# Altium schematic sheet BMS1.SchDoc
size A4; SheetNumber: 12; SheetTotal: 13
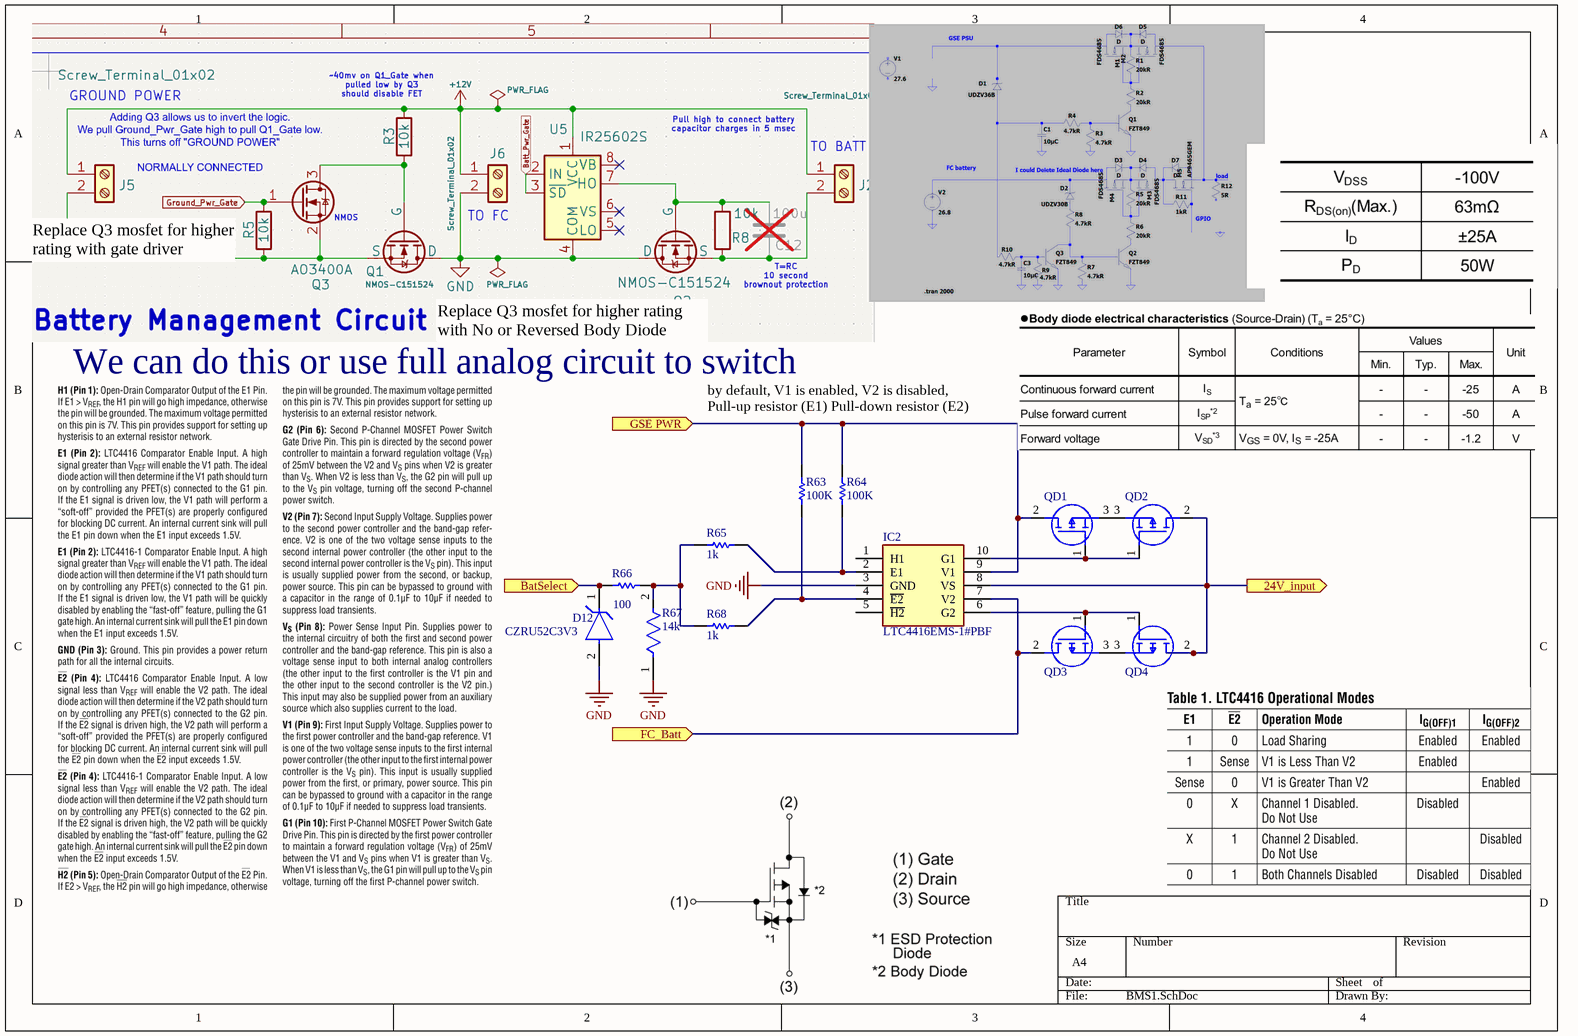
[diagram p0: BMS1.SchDoc]

## Parts
D12  CZRU52C3V3  [FP-0603-SOD-523F-MFG]
IC2  LTC4416EMS-1#PBF  [SOP50P490X110-10N]
QD1  (no value)  [R6024KNJTL]
QD2  (no value)  [R6024KNJTL]
QD3  (no value)  [R6024KNJTL]
QD4  (no value)  [R6024KNJTL]
R63  100K  [RESC1609X55X30ML10T20]
R64  100K  [RESC1609X55X30ML10T20]
R65  1k  [RESC2013X60X35ML10T20]
R66  100  [RESC1608X55X30LL15T15]
R67  14k  [FP-CRCW0603-e3-IPC_B]
R68  1k  [RESC2013X60X35ML10T20]

## Ports
24V_input (out), BatSelect (in), FC_Batt (in), GSE PWR (in)

## Nets
GND: D12.2(A) IC2.3(GND) R67.1
24V_input: IC2.8(VS) QD2.2(D) QD4.2(D) ; port 24V_input
BatSelect: D12.1(C) R66.1 ; port BatSelect
FC_Batt: IC2.7(V2) QD3.2(D) ; port FC_Batt
GSE PWR: IC2.9(V1) QD1.2(D) R63.2 R64.2 ; port GSE PWR
NetIC2_2: IC2.2(E1) R64.1 R65.2
NetIC2_4: IC2.4(~{E2}) R63.1 R68.2
NetIC2_6: IC2.6(G2) QD3.1(G) QD4.1(G)
NetIC2_10: IC2.10(G1) QD1.1(G) QD2.1(G)
NetQD1_3: QD1.3(S) QD2.3(S)
NetQD3_3: QD3.3(S) QD4.3(S)
NetR65_1: R65.1 R66.2 R67.2 R68.1

Not connected (* = marked no-connect by the designer): IC2 1(H1) 5(~{H2})

## Notes on the sheet
- Replace Q3 mosfet for higher rating with gate driver
- We can do this or use full analog circuit to switch
- Replace Q3 mosfet for higher rating with No or Reversed Body Diode
- by default, V1 is enabled, V2 is disabled, Pull-up resistor (E1) Pull-down resistor (E2)

## Library data of the parts
D12 = CMP-20229-000003-1: DIODE ZENER 3.3V 150MW 0603; Zener Current: 5mA; Tolerance: 5%; Output Current: 500mA; Impedance: 95R; Element Configuration: Single; Max Reverse Leakage Current: 25uA; Max Operating Temperature: 125°C; Max Power Dissipation: 150mW; Power Rating: 150mW; Lead Free: Lead Free; Mount: Surface Mount; Packaging: Tape and Reel; Voltage Tolerance: 5%; Power Dissipation: 150mW; Zener Voltage: 3.3V; Min Operating Temperature: -55°C; Case/Package: SMD/SMT; Voltage Rating (DC): 3.3V; Package Quantity: 1
IC2 = LTC4416EMS-1#PBF: Integrated Circuit; Manufacturer_Name: Analog Devices; Datasheet Link: https://www.analog.com/media/en/technical-documentation/data-sheets/4416fa.pdf; Height: 1.1mm; Manufacturer_Part_Number: LTC4416EMS-1#PBF; Mouser Part Number: 584-LTC4416EMS-1#PBF; Mouser Price/Stock: https://www.mouser.co.uk/ProductDetail/Analog-Devices/LTC4416EMS-1PBF?qs=hVkxg5c3xu9mDay6QbsUoQ%3D%3D; Arrow Part Number: LTC4416EMS-1#PBF; Arrow Price/Stock: https://www.arrow.com/en/products/ltc4416ems-1pbf/analog-devices?region=nac
QD1-QD4 = RSJ250P10FRATL: MOSFET (P-Channel) RSJ250P10FRATL; Manufacturer_Name: ROHM Semiconductor; Datasheet Link: https://fscdn.rohm.com/en/products/databook/datasheet/discrete/transistor/mosfet/rsj250p10fratl-e.pdf; Height: 4.7mm; Manufacturer_Part_Number: RSJ250P10FRATL; Mouser Part Number: 755-RSJ250P10FRATL; Mouser Price/Stock: https://www.mouser.co.uk/ProductDetail/ROHM-Semiconductor/RSJ250P10FRATL?qs=4v%252BiZTmLVHFYSXh0Zm27Bg%3D%3D
R63 R64 = CMP-2000-03687-1: RES 100K OHM 0.1% 1/10W 0603; Manufacturer: Vishay Dale; Part Number: TNPW0603100KBETA
R65 R68 = CMP-2100-03671-1: Chip Resistor, 1 KOhm, +/- 1%, 125 mW, -55 to 155 degC, 0805 (2012 Metric), RoHS, Tape and Reel; Manufacturer: Yageo; Temperature Coefficient: 100ppm/degreesC; Voltage Rating (DC): 150V; Max Power Dissipation: 125mW; Resistance: 1KOhm; Number of Pins: 2; Number of Terminations: 2; Datasheet URL: http://www.yageo.com/NewPortal/yageodocoutput?fileName=/pdf/R-Chip/PYu-RC_Group_51_RoHS_L_5.pdf; Length: 0.079inch; Package Description: 2-Pin Surface Mounted Device, Body 2 x 1.25 mm; Depth: 1.25mm; Height: 0.024inch; Military Standard: Not; Case/Package: 0805; Package Reference: 0805; RoHSCompliant: true; Lead Free: LeadFree; Packaging: TapeandReel; Package Quantity: 1; Datasheet Version: Rev. 5, 10/2016; Tolerance: 1%; Min Operating Temperature: -55degC; Voltage Rating: 150V; Composition: ThickFilm; Case Code (Imperial): 0805; Power Rating: 125mW; Width: 0.049inch; Case Code (Metric): 2012; Manufacturer URL: http://www.yageo.com/; Max Operating Temperature: 155degC; REACH SVHC: Unknown; Termination: SMD/SMT
R66 = CMP-2000-00179-1: ERJ-3EKF1000V 100 Ohms ±1% 0.1W, 1/10W Chip Resistor 0603 (1608 Metric) Automotive AEC-Q200 Thick Film; Manufacturer: Panasonic; Part Number: ERJ-3EKF1000V
R67 = CMP-1012-00638-3: RES Thick Film, 14kΩ, 1%, 0.1W, 100ppm/°C, 0603; Power Rating: 100mW; Resistance: 14kR; Voltage Rating (DC): 75V; Tolerance: 1%; Termination: SMD/SMT; Weight: 7.1E-05oz; Min Operating Temperature: -55°C; Number of Pins: 2; Temperature Coefficient: 100ppm/°C; Packaging: Tape and Reel; Military Standard: Not; Case Code (Metric): 1608; Lead Free: Lead Free; Depth: 0.85mm; Case Code (Imperial): 0603; Mount: Surface Mount; Max Operating Temperature: 155°C; Width: 0.85mm; Number of Terminations: 2; Features: Automotive AEC-Q200; Max Power Dissipation: 100mW; Radiation Hardening: No; Length: 1.55mm; Composition: Thick Film; Voltage Rating: 75V; Case/Package: 0603; Contact Plating: Tin; Height: 0.45mm; Package Quantity: 10